# EAGLE design MA702 (EAGLE 9.6.2)
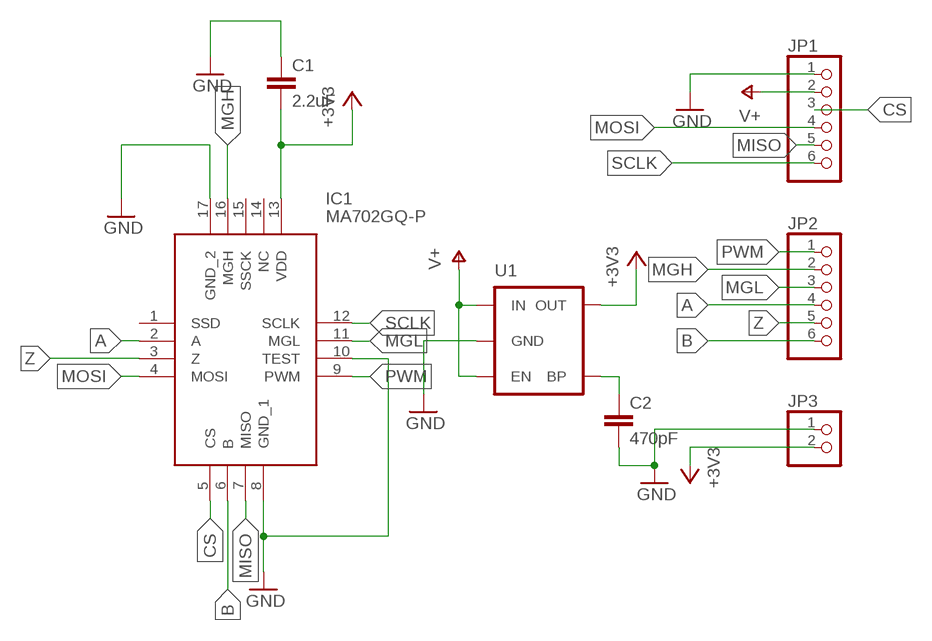
[diagram p0: schematic, sheet 1]

## Parts
C1  2.2uF  C-EUC0603  [C0603]
C2  470pF  C-EUC0603  [C0603]
IC1  MA702GQ-P  [QFN50P300X300X100-17N]
JP1  PINHD-1X06_2.54-S  [1X06-S]
JP2  PINHD-1X06_2.54-S  [1X06-S]
JP3  PINHD-1X02_2.54-S  [1X02-S]
U1  SPARKFUN-POWERIC_MIC52053.3V  [SPARKFUN-POWERIC_SOT23-5]

## Nets
+3V3: C1.2 IC1.13(VDD) JP3.2 U1.5(OUT)
A: IC1.2(A) JP2.4
B: IC1.6(B) JP2.6
CS: IC1.5(CS) JP1.3
GND: C1.1 C2.2 IC1.8(GND_1) IC1.10(TEST) IC1.17(GND_2) JP1.1 JP3.1 U1.2(GND)
MGH: IC1.16(MGH) JP2.2
MGL: IC1.11(MGL) JP2.3
MISO: IC1.7(MISO) JP1.5
MOSI: IC1.4(MOSI) JP1.4
N$1: C2.1 U1.4(BP)
PWM: IC1.9(PWM) JP2.1
SCLK: IC1.12(SCLK) JP1.6
V+: JP1.2 U1.1(IN) U1.3(EN)
Z: IC1.3(Z) JP2.5
Unconnected: IC1.1(SSD) IC1.14(NC) IC1.15(SSCK)

## Library data of the parts
C1 C2 = rcl:C-EU: CAPACITOR, European symbol; SPICEPREFIX: C
IC1 = SamacSys_Parts:MA702GQ-P: Board Mount Hall Effect / Magnetic Sensors 12-bit, digital, contactless angle sensor with ABZ incremental & PWM outputs Source: Datasheet <https://www.monolithicpower.com/pub/media/document/m/a/ma702_r1.0.pdf>; DESCRIPTION: Board Mount Hall Effect / Magnetic Sensors 12-bit, digital, contactless angle sensor with ABZ incremental & PWM outputs; HEIGHT: 1mm; MANUFACTURER_NAME: Monolithic Power Systems (MPS); MANUFACTURER_PART_NUMBER: MA702GQ-P; MOUSER_PART_NUMBER: 946-MA702GQ-P; MOUSER_PRICE-STOCK: https://www.mouser.com/Search/Refine.aspx?Keyword=946-MA702GQ-P
JP1 JP2 = pinhead-2:PINHD-1X06: PIN HEADER
JP3 = pinhead-2:PINHD-1X02: PIN HEADER
U1 = canable_candapter:SPARKFUN-POWERIC_MIC5205: MIC5205 150mA vreg 3.3V - VREG-00822 5V - VREG-00823; PROD_ID: VREG-00822

## Board
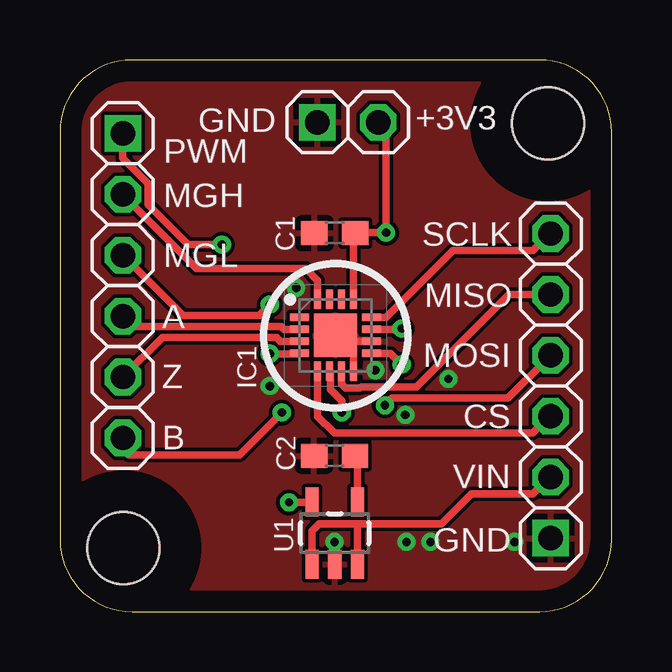
[diagram p1: board, top side]
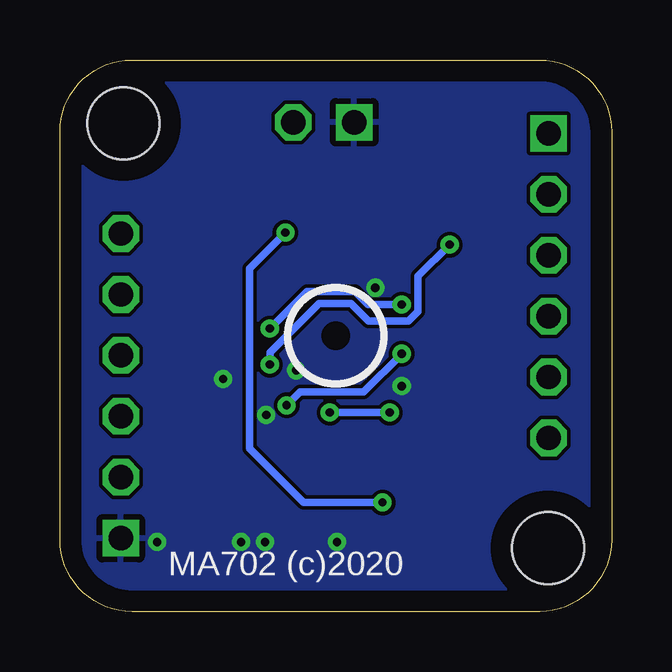
[diagram p2: board, bottom side, seen from below]

Size 23 x 23 mm. Coordinates in mm from the lower left corner, seen from the top.
Outline: 0,20 0,3 arc90 3,0 20,0 arc90 23,3 23,20 arc90 20,23 3,23 arc90 0,20
Copper layers (1*16): Top 0.035mm / dielectric 1.5mm / Bottom 0.035mm
Design rules "default *": minimum track width 6mil, minimum drill 0.35mm, track to track 6mil, track to pad 6mil, pad to pad 6mil, via to via 6mil, smd to smd 6mil, copper to edge 35mil, drill to drill 6mil, minimum pad ring 10mil, minimum via ring 8mil, stop-mask expansion 4mil, vias tented up to drill 0.5mm, thermal gap 10mil
Holes 3 mm at 2.65,2.65 20.35,20.35
tRestrict: area 17.1,17.1 to 23.6,23.6; area -0.6,-0.6 to 5.9,5.9
bRestrict: area 10.9,10.9 to 12.1,12.1

### Footprints (pad centres in the part's own frame; a part is rotated, then mirrored left to right if it is on the bottom)
C0603 = smd 1.1 x 1: 1 -0.85,0; 2 0.85,0
QFN50P300X300X100-17N = smd 0.8 x 0.3: 1 -1.5,0.75; 2 -1.5,0.25; 3 -1.5,-0.25; 4 -1.5,-0.75; 9 1.5,-0.75; 10 1.5,-0.25; 11 1.5,0.25; 12 1.5,0.75 | smd 0.3 x 0.8: 5 -0.75,-1.5; 6 -0.25,-1.5; 7 0.25,-1.5; 8 0.75,-1.5; 13 0.75,1.5; 14 0.25,1.5; 15 -0.25,1.5; 16 -0.75,1.5 | smd 1.8 x 1.8: 17 0,0
1X06-S = drill 1.016 square: 1 -6.35,0 | drill 1.016 octagon: 2 -3.81,0; 3 -1.27,0; 4 1.27,0; 5 3.81,0; 6 6.35,0
1X02-S = drill 1.016 square: 1 -1.27,0 | drill 1.016 octagon: 2 1.27,0
SPARKFUN-POWERIC_SOT23-5 = smd 0.55 x 1.2: 1 -0.95,-1.3; 2 0,-1.3; 3 0.95,-1.3; 4 0.95,1.3; 5 -0.95,1.3

### Placement (x,y rotation side)
C1  11.46,15.78 0 top
C2  11.45,6.5 180 top
IC1  11.49,11.52 0 top
JP1  20.46,9.41 90 top
JP2  2.62,13.59 270 top
JP3  12,20.4 0 top
U1  11.46,3.27 0 top

### Tracks (layer width: path | path; a pad name or v marks a point on that pad's centre or on a via)
+3V3  (via drill 0.35)
  Top 0.305: C1.2 12.33,15.8 | 12.33,15.8 12.23,15.8 12.24,15.79 IC1.13 | 12.33,15.8 v13.6,15.8 13.6,20.07 JP3.2 | U1.5 10.49,4.55 v9.55,4.55
  Bottom 0.305: v9.55,4.55 12.85,4.55 15.1,6.8 15.1,14.3 v13.6,15.8
A
  Top 0.305: IC1.2 9.34,11.77 9.22,11.89 2.6,11.89 2.57,11.92 2.57,12.27 JP2.4
B  (via drill 0.35)
  Top 0.305: IC1.6 11.28,9.98 11.28,9.25 11.75,8.78 v11.75,8.3 | v9.25,8.3 7.49,6.54 2.87,6.54 2.57,6.84 2.57,7.19 JP2.6
  Bottom 0.305: v11.75,8.3 v9.25,8.3
CS
  Top 0.305: IC1.5 10.73,8.14 11.44,7.44 19.71,7.44 20.41,8.14 JP1.3
GND  (via drill 0.35)
  Top 0.305: IC1.10 12,11.27 | 12,11.27 11.74,11.27 IC1.17 | IC1.8 12.24,11.03 12,11.27
  other vias: 14.4,8.2 16.2,9.7 8.75,9.4 9.85,13.5 11.45,2.9 13.15,10.06 14.45,2.9 15.45,2.9 18.95,2.9
  pour Top: -0.5,23.5 -0.5,-0.5 23.5,-0.5 23.5,23.5
  pour Bottom: -0.5,23.5 -0.5,-0.5 23.5,-0.5 23.5,23.5
MGH
  Top 0.305: IC1.16 10.74,13.81 10.25,14.3 5.7,14.3 2.62,17.38 JP2.2
MGL  (via drill 0.35)
  Top 0.305: v8.75,12.8 8.3,12.35 5.13,12.35 JP2.3 | v14.25,11.8 14.22,11.77 IC1.11
  Bottom 0.305: v14.25,11.8 12.7,13.35 10.7,13.35 10.15,12.8 v8.75,12.8
MISO
  Top 0.305: JP1.5 18.71,13.22 14.86,9.37 12.57,9.37 12.52,9.32 11.91,9.32 11.73,9.49 IC1.7
MOSI  (via drill 0.35)
  Top 0.305: v8.75,10.75 9.97,10.75 IC1.4 | JP1.4 18.68,8.9 13.85,8.9 v13.55,8.6
  Bottom 0.305: v8.75,10.75 10.35,9.15 13,9.15 v13.55,8.6
N$1
  Top 0.305: U1.4 12.41,6.39 C2.1
PWM  (via drill 0.35)
  Top 0.305: v6.75,15.3 5.35,15.3 3.69,16.96 3.69,17.84 2.62,18.91 JP2.1 | v14.25,10.3 13.78,10.77 IC1.9
  Bottom 0.305: v6.75,15.3 8.07,13.98 8.07,12.52 8.47,12.12 10.13,12.12 10.87,12.85 12.2,12.85 14.25,10.8 v14.25,10.3
SCLK
  Top 0.305: IC1.12 13.59,12.27 16.38,15.06 19.71,15.06 20.41,15.76 JP1.6
V+
  Top 0.305: JP1.2 20.41,5.6 19.71,4.9 17.15,4.9 15.91,3.67 12.4,3.67 | 12.4,3.67 10.8,3.67 10.51,3.37 U1.1 | U1.3 12.41,3.65 12.4,3.67
Z
  Top 0.305: IC1.3 9.2,11.27 9.03,11.43 4.27,11.43 JP2.5

### Text on the board
tNames: GND | +3V3 | PWM | MGH | SCLK | MGL | MISO | A | MOSI | Z | CS | B | VIN | GND
bNames: MA702 (c)2020